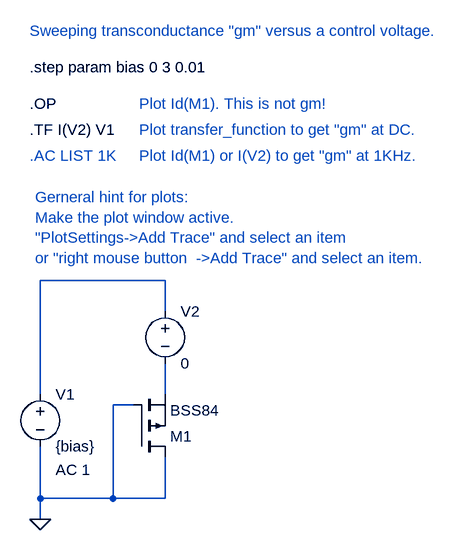
[diagram p0: schematic gm_sweep.asc]
gm_sweep.asc, the LTspice schematic file:
Version 4
SHEET 1 880 680
WIRE 96 288 96 240
WIRE 96 112 -96 112
WIRE 96 384 96 448
WIRE 96 448 16 448
WIRE -96 288 -96 112
WIRE -96 368 -96 448
WIRE 48 304 16 304
WIRE 16 304 16 448
WIRE 16 448 -96 448
WIRE -96 480 -96 448
WIRE 96 160 96 112
FLAG -96 480 0
SYMBOL pmos 48 384 M180
SYMATTR InstName M1
SYMATTR Value BSS84
SYMBOL voltage -96 272 R0
WINDOW 123 24 132 Left 0
WINDOW 39 0 0 Left 0
SYMATTR InstName V1
SYMATTR Value {bias}
SYMATTR Value2 AC 1
SYMBOL voltage 96 144 R0
SYMATTR InstName V2
SYMATTR Value 0
TEXT -112 -216 Left 0 !.step param bias 0 3 0.01
TEXT -112 -160 Left 0 !.OP
TEXT -112 -120 Left 0 !.TF I(V2) V1
TEXT -112 -80 Left 0 ;.AC LIST 1K
TEXT 56 -80 Left 0 ;Plot Id(M1) or I(V2) to get "gm" at 1KHz.
TEXT 56 -120 Left 0 ;Plot transfer_function to get "gm" at DC.
TEXT 56 -160 Left 0 ;Plot Id(M1). This is not gm!
TEXT -112 -272 Left 0 ;Sweeping transconductance "gm" versus a control voltage.
TEXT -104 -16 Left 0 ;Gerneral hint for plots:\nMake the plot window active. \n"PlotSettings->Add Trace" and select an item\nor "right mouse button  ->Add Trace" and select an item.

The netlist it stands for:
* gm_sweep.asc
M1 0 0 N001 N001 BSS84
V1 N002 0 {bias} AC 1
V2 N002 N001 0
.model NMOS NMOS
.model PMOS PMOS
.lib standard.mos
.step param bias 0 3 0.01
.OP
.TF I(V2) V1
* .AC LIST 1K
* Plot Id(M1) or I(V2) to get "gm" at 1KHz.
* Plot transfer_function to get "gm" at DC.
* Plot Id(M1). This is not gm!
* Sweeping transconductance "gm" versus a control voltage.
* Gerneral hint for plots:
* Make the plot window active.
* "PlotSettings->Add Trace" and select an item
* or "right mouse button  ->Add Trace" and select an item.
.backanno
.end